# Altium schematic sheet Top-Sheet.SchDoc
size 420 x 297 mm; SheetNumber: 1; SheetTotal: 7
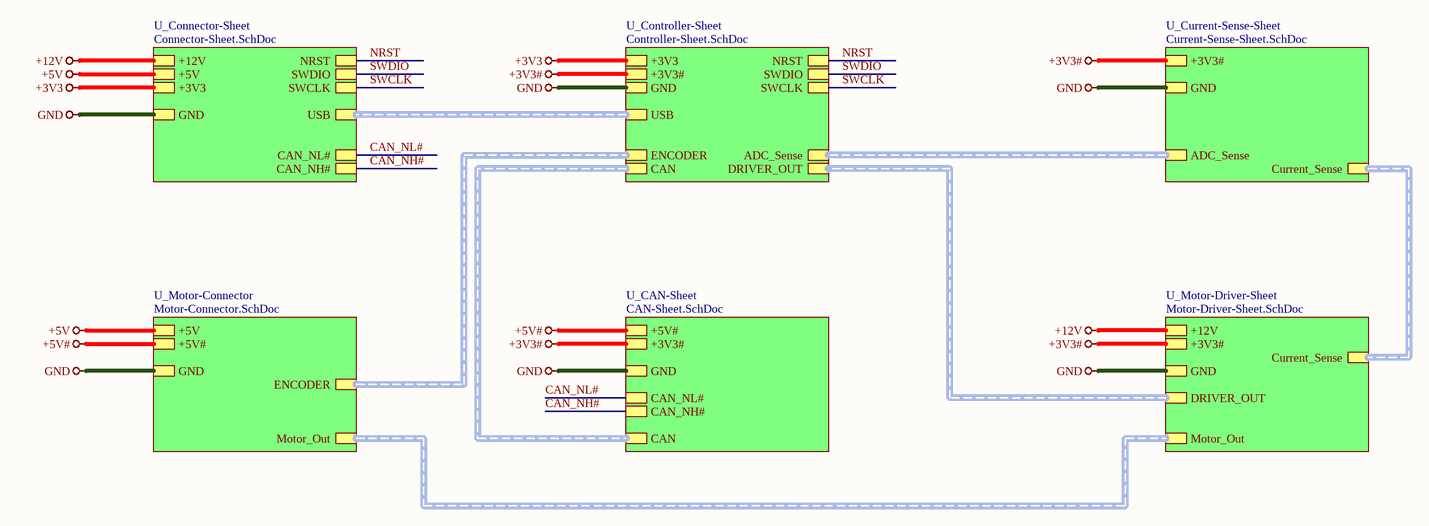
[diagram p0: Top-Sheet.SchDoc]

## Sub-sheets
U_CAN-Sheet = CAN-Sheet.SchDoc: CAN (harness CAN), +3V3#, GND, +5V#, CAN_NL#, CAN_NH#
U_Connector-Sheet = Connector-Sheet.SchDoc: USB (harness USB), +12V, +5V, +3V3, GND, CAN_NL#, CAN_NH#, SWCLK, SWDIO, NRST
U_Controller-Sheet = Controller-Sheet.SchDoc: ADC_Sense (harness ADC_Sense), ENCODER (harness ENCODER), USB (harness USB), +3V3, GND, DRIVER_OUT (harness DRIVER_OUT), CAN (harness CAN), SWCLK, SWDIO, NRST, +3V3#
U_Current-Sense-Sheet = Current-Sense-Sheet.SchDoc: Current_Sense (harness Current_Sense), ADC_Sense (harness ADC_Sense), GND, +3V3#
U_Motor-Connector = Motor-Connector.SchDoc: Motor_Out (harness Motor_Out), +5V, GND, ENCODER (harness ENCODER), +5V#
U_Motor-Driver-Sheet = Motor-Driver-Sheet.SchDoc: Current_Sense (harness Current_Sense), Motor_Out (harness Motor_Out), DRIVER_OUT (harness DRIVER_OUT), +12V, GND, +3V3#

## Nets
+3V3: sheet U_Connector-Sheet/+3V3, sheet U_Controller-Sheet/+3V3
+3V3#: sheet U_CAN-Sheet/+3V3#, sheet U_Controller-Sheet/+3V3#, sheet U_Current-Sense-Sheet/+3V3#, sheet U_Motor-Driver-Sheet/+3V3#
+5V: sheet U_Connector-Sheet/+5V, sheet U_Motor-Connector/+5V
+5V#: sheet U_CAN-Sheet/+5V#, sheet U_Motor-Connector/+5V#
+12V: sheet U_Connector-Sheet/+12V, sheet U_Motor-Driver-Sheet/+12V
GND: sheet U_CAN-Sheet/GND, sheet U_Connector-Sheet/GND, sheet U_Controller-Sheet/GND, sheet U_Current-Sense-Sheet/GND, sheet U_Motor-Connector/GND, sheet U_Motor-Driver-Sheet/GND
CAN_NH#: sheet U_CAN-Sheet/CAN_NH#, sheet U_Connector-Sheet/CAN_NH#
CAN_NL#: sheet U_CAN-Sheet/CAN_NL#, sheet U_Connector-Sheet/CAN_NL#
NRST: sheet U_Connector-Sheet/NRST, sheet U_Controller-Sheet/NRST
SWCLK: sheet U_Connector-Sheet/SWCLK, sheet U_Controller-Sheet/SWCLK
SWDIO: sheet U_Connector-Sheet/SWDIO, sheet U_Controller-Sheet/SWDIO

## Buses and harness runs
harness sheet U_CAN-Sheet/CAN = sheet U_Controller-Sheet/CAN
harness sheet U_Connector-Sheet/USB = sheet U_Controller-Sheet/USB
harness sheet U_Controller-Sheet/ADC_Sense = sheet U_Current-Sense-Sheet/ADC_Sense
harness sheet U_Controller-Sheet/DRIVER_OUT = sheet U_Motor-Driver-Sheet/DRIVER_OUT
harness sheet U_Controller-Sheet/ENCODER = sheet U_Motor-Connector/ENCODER
harness sheet U_Current-Sense-Sheet/Current_Sense = sheet U_Motor-Driver-Sheet/Current_Sense
harness sheet U_Motor-Connector/Motor_Out = sheet U_Motor-Driver-Sheet/Motor_Out

## Notes on the sheet
- File:
- Title:
- Date:
- Page
- Num:
- Total:
- Drawn By: Huzaifa Ali